# Altium schematic sheet INA219_CH4.SchDoc
size A4; SheetNumber: 7; SheetTotal: 13
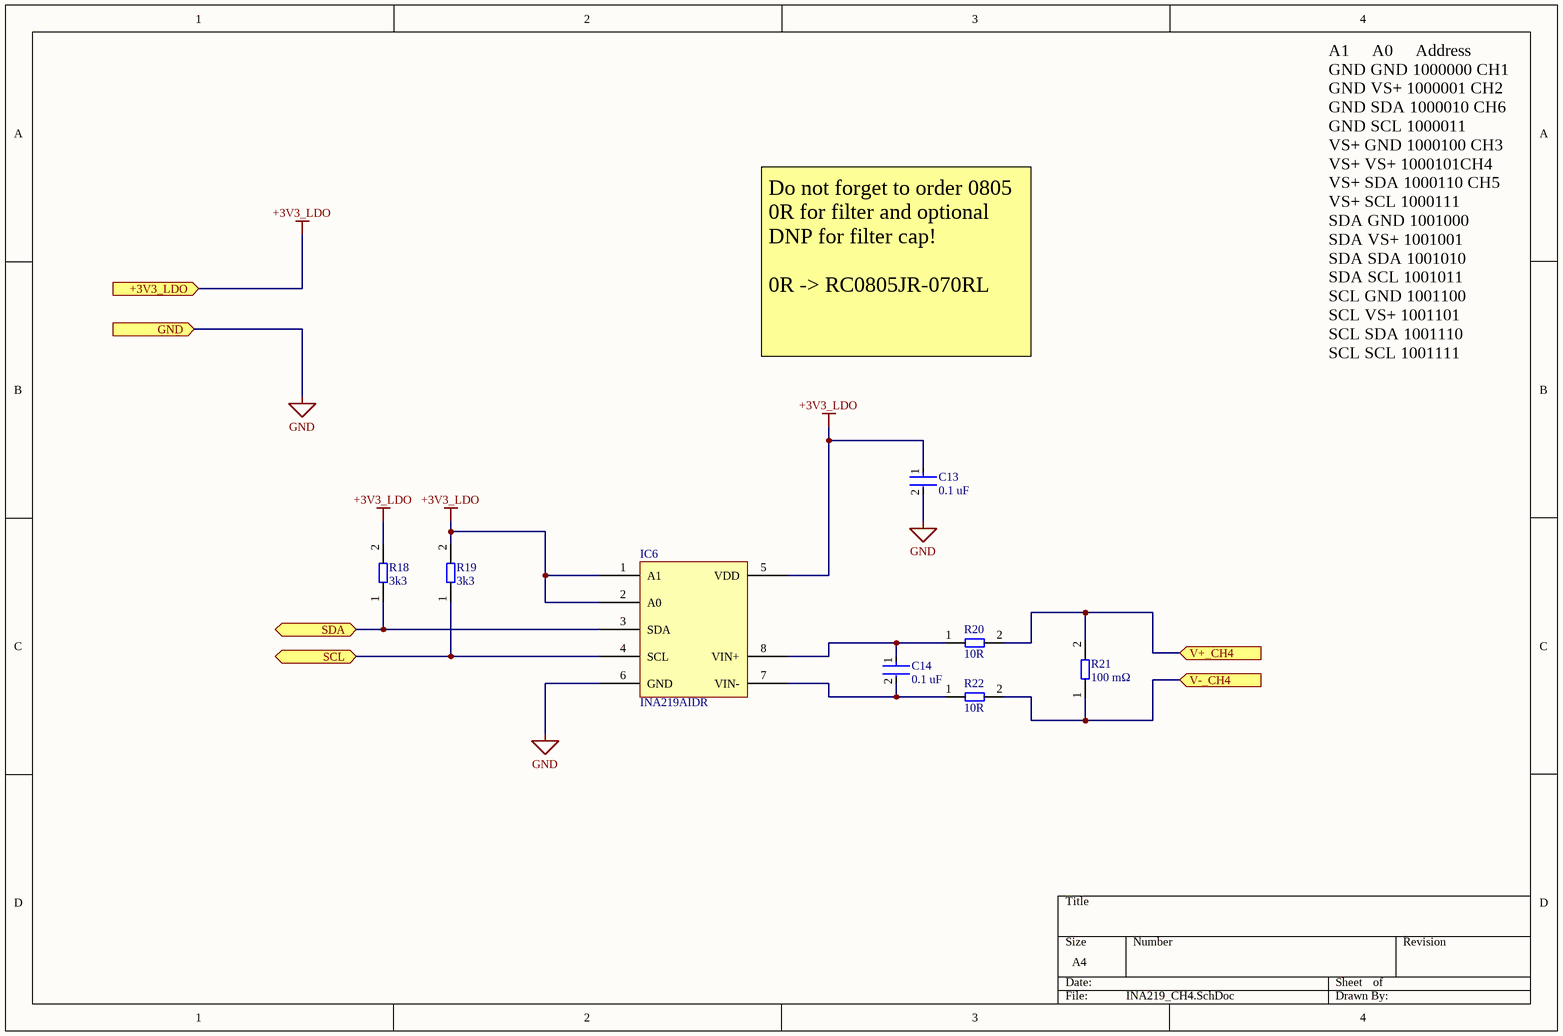
[diagram p0: INA219_CH4.SchDoc]

## Parts
C13  0.1 uF  [FP-C0805C-DN-MFG]
C14  0.1 uF  [FP-C0805C-DN-MFG]
IC6  INA219AIDR  [INA219AIDR]
R18  3k3  [0805 Resistor - IPC A]
R19  3k3  [0805 Resistor - IPC A]
R20  10R  [0805 Resistor - IPC A]
R21  100 mΩ  [PE2512FKM070R1L]
R22  10R  [0805 Resistor - IPC A]

## Ports
+3V3_LDO (in, see Callisto Control Board[7B], 3V3 LDO[3B], BME280[2B], Driver Board[1B], INA219_CH1[1A], INA219_CH2[1B], INA219_CH3[1B], INA219_CH5[1B], INA219_CH6[1B]), GND (in, see Callisto Control Board[7B], 3V3 LDO[3B], BME280[3B], Driver Board[1B], INA219_CH1[1A], INA219_CH2[1B], INA219_CH3[1B], INA219_CH5[1B], INA219_CH6[1B], Raspberry Pi[1C]), SCL (bidir, see Callisto Control Board[7C], BME280[3B], INA219_CH1[1C], INA219_CH2[1C], INA219_CH3[1C], INA219_CH5[1C], INA219_CH6[1C], Raspberry Pi[1B]), SDA (bidir, see Callisto Control Board[7B], BME280[3B], INA219_CH1[1C], INA219_CH2[1C], INA219_CH3[1C], INA219_CH5[1C], INA219_CH6[1C], Raspberry Pi[1A]), V+_CH4 (in), V-_CH4 (in)

## Nets
+3V3_LDO: C13.1 IC6.1(A1) IC6.2(A0) IC6.5(VDD) R18.2 R19.2 ; port +3V3_LDO
GND: C13.2 IC6.6(GND) ; port GND
SCL: IC6.4(SCL) R19.1 ; port SCL
SDA: IC6.3(SDA) R18.1 ; port SDA
V+_CH4: R20.2 R21.2 ; port V+_CH4
V-_CH4: R21.1 R22.2 ; port V-_CH4
NetC14_1: C14.1 IC6.8(VIN+) R20.1
NetC14_2: C14.2 IC6.7(VIN-) R22.1

## Notes on the sheet
- Do not forget to order 0805 0R for filter and optional DNP for filter cap!
  0R -> RC0805JR-070RL
- A1     A0     Address
  GND GND 1000000 CH1
  GND VS+ 1000001 CH2
  GND SDA 1000010 CH6
  GND SCL 1000011
  VS+ GND 1000100 CH3
  VS+ VS+ 1000101CH4
  VS+ SDA 1000110 CH5
  VS+ SCL 1000111
  SDA GND 1001000
  SDA VS+ 1001001
  SDA SDA 1001010
  SDA SCL 1001011
  SCL GND 1001100
  SCL VS+ 1001101
  SCL SDA 1001110
  SCL SCL 1001111

## Library data of the parts
C13 C14 = CMP-03020-002581-2: C0805 0.10 μF X7R 30ppm/°C 20.00% 50 V C0805C104M5RAC; Manufacturer: KEMET; Capacitance: 0.10 μF; Voltage Rating: 50 V; Value: 0.10 μF; Tolerance: 0.2; Material: Ceramic; Category: Cap; Temperature: -55°C to +125°C; Lead Free: Yes; Device Class L3: Ceramic Capacitors; Package: C0805C-DN; Height: 0.88mm; Temperature Range High: +125°C; Device Class L2: Capacitors; Manufacturer Part Number: C0805C104M5RAC; Device Class L1: Passive Components; Temperature Coefficient: 30ppm/°C; ComponentLink2Description: Datasheet; RoHS: TRUE; Temperature Range Low: -55°C; ComponentLink2URL: https://content.kemet.com/datasheets/KEM_C1003_C0G_SMD.pdf; Temperature Characteristic: X7R; Mouser Description: Multilayer Ceramic Capacitors MLCC - SMD/SMT 50volts 0.1uF 20% X7R; Octopart: https://octopart.com/c0805c104m5rac-kemet-2226142; Ipc Land Pattern Name: CAPC200125X78; Automotive: No
IC6 = INA219AIDR: Current & Power Monitors & Regulators Zero-Drift,Bi-Dir Crnt/Pwr Monitor
R18 R19 = RE0805FRE073K3L: Thick Film Resistors - SMD 3.3 kOhms 125 mW 0805 1% / RE0805FRE073K3L
R20 R22 = RC0805FR-0710RL: Thick Film Resistors - SMD 10 Ohms 125 mW 0805 1% / RC0805FR-0710RL
R21 = PE2512FKM070R1L: Current Sense Resistors - SMD 100 mOhms 1 Watt 1 % 75 ppm/C AEC-Q200 / PE2512FKM070R1L